# Altium project Adapter_UARTSPI_RS485.PrjPcb
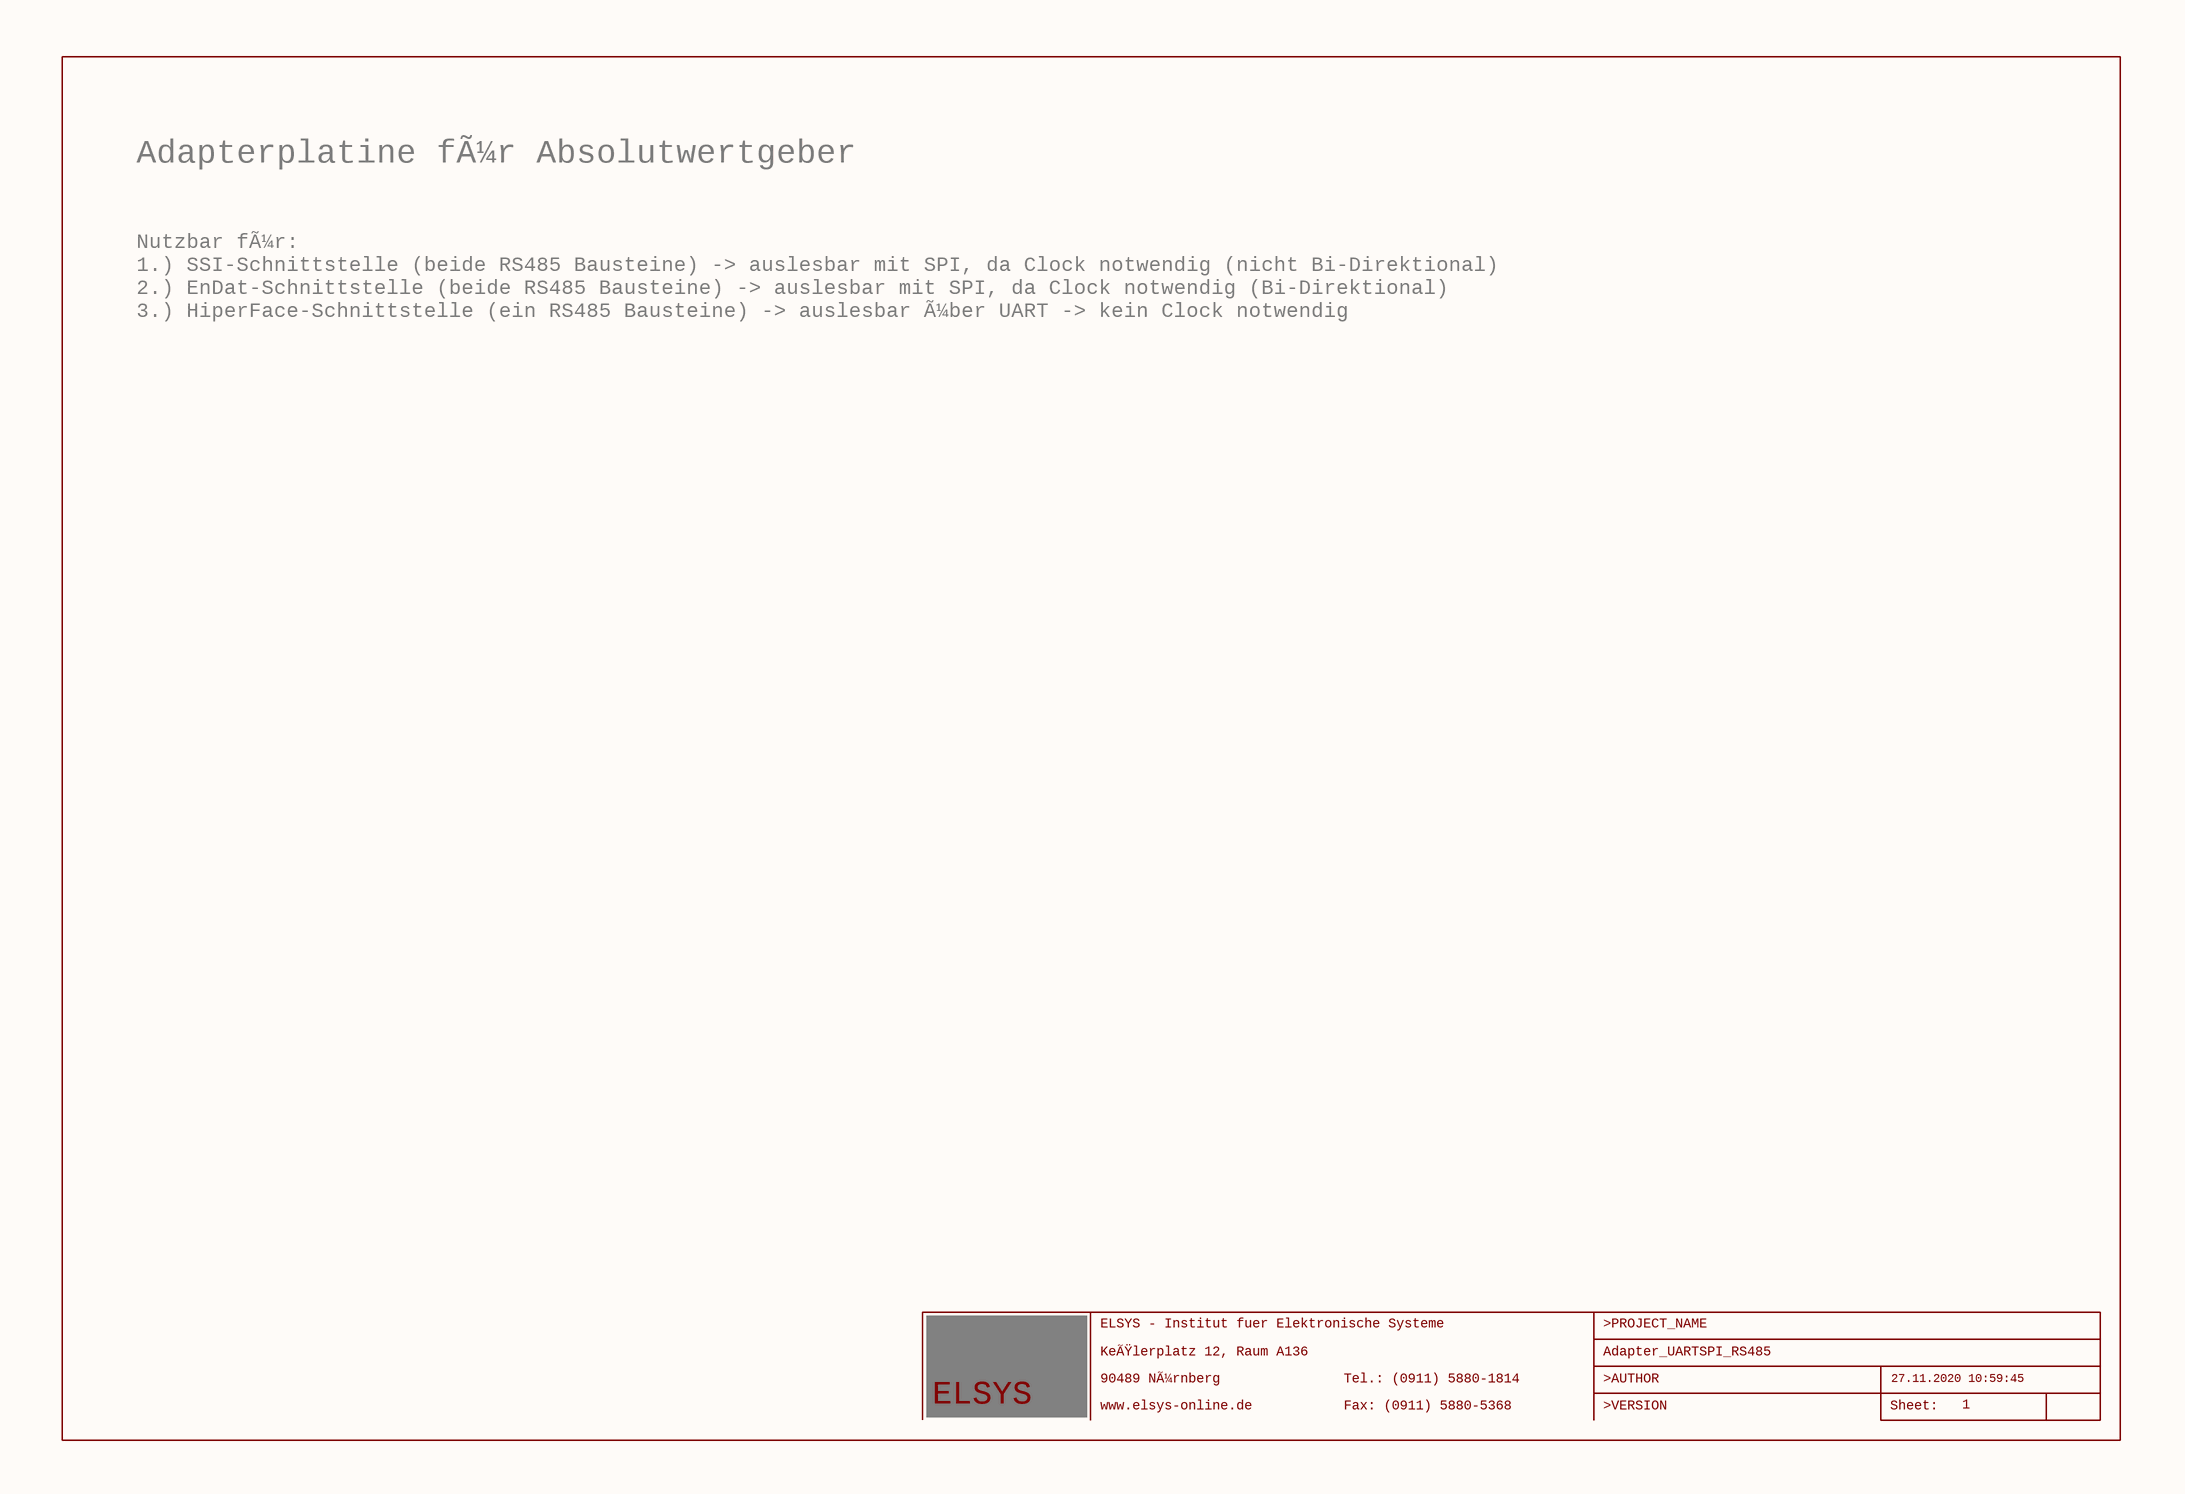
[diagram p0: Adapter_UARTSPI_RS485_0.SchDoc]
2 sheets, 47 parts. Net scope: global (net labels, ports and power ports of the same name join across sheets).
Board file: Adapter_UARTSPI_RS485.PcbDoc
Sheets:
  Adapter_UARTSPI_RS485_0.SchDoc
  Adapter_UARTSPI_RS485_1.SchDoc

## Sheet Adapter_UARTSPI_RS485_0.SchDoc
size 409 x 279 mm; Author: Wendel; PROJECT_NAME: Adapter_UARTSPI_RS485; VERSION: Version 1.0; Origin: Eagle

### Parts
FRAME3  DRAWING_NAME: Adapter_UARTSPI_RS485  LAST_DATE_TIME: 27.11.2020 10:59:45  SHEET: 1  Sheet: Sheet:  ELSYS-InstitutfuerElektronischeSysteme: ELSYS - Institut fuer Elektronische Systeme  AUTHOR: >AUTHOR  VERSION: >VERSION  KeÃŸlerplatz12,RaumA136: KeÃŸlerplatz 12, Raum A136  90489NÃ¼rnberg: 90489 NÃ¼rnberg  Tel.:(0911)5880-1814: Tel.: (0911) 5880-1814  Fax:(0911)5880-5368: Fax: (0911) 5880-5368  PROJECT_NAME: >PROJECT_NAME  (hidden comment: A3L-LOC)

### Notes on the sheet
- Adapterplatine fÃ¼r Absolutwertgeber
- Nutzbar fÃ¼r:
  1.) SSI-Schnittstelle (beide RS485 Bausteine) -> auslesbar mit SPI, da Clock notwendig (nicht Bi-Direktional)
  2.) EnDat-Schnittstelle (beide RS485 Bausteine) -> auslesbar mit SPI, da Clock notwendig (Bi-Direktional)
  3.) HiperFace-Schnittstelle (ein RS485 Bausteine) -> auslesbar Ã¼ber UART -> kein Clock notwendig

### Library data of the parts
FRAME3 = A3L-LOC: RAHMEN   ELSYS Rahmen fuer Schaltplan; GateName_1: G$1; SymbolName_1: A3L-LOC; LibraryName: Elsys - Rahmen - Eagle v5; DeviceSetName: A3L-LOC; www.elsys-online.de: www.elsys-online.de; ELSYS: ELSYS

## Sheet Adapter_UARTSPI_RS485_1.SchDoc: Adapter_UARTSPI_RS485
size 414 x 279 mm; Date: 27.11.2020 10:59:45; SheetNumber: 2; Author: Wendel; PROJECT_NAME: Adapter_UARTSPI_RS485; VERSION: Version 1.0; Origin: Eagle; GateName_1: G$1; SymbolName_1: A3L-LOC; LibraryName: Elsys - Rahmen - Eagle v5; DeviceSetName: A3L-LOC; Sheet: Sheet:; ELSYS-InstitutfuerElektronischeSysteme: ELSYS - Institut fuer Elektronische Systeme; KeÃŸlerplatz12,RaumA136: KeÃŸlerplatz 12, Raum A136; 90489NÃ¼rnberg: 90489 NÃ¼rnberg; www.elsys-online.de: www.elsys-online.de; Tel.:(0911)5880-1814: Tel.: (0911) 5880-1814; Fax:(0911)5880-5368: Fax: (0911) 5880-5368; ELSYS: ELSYS
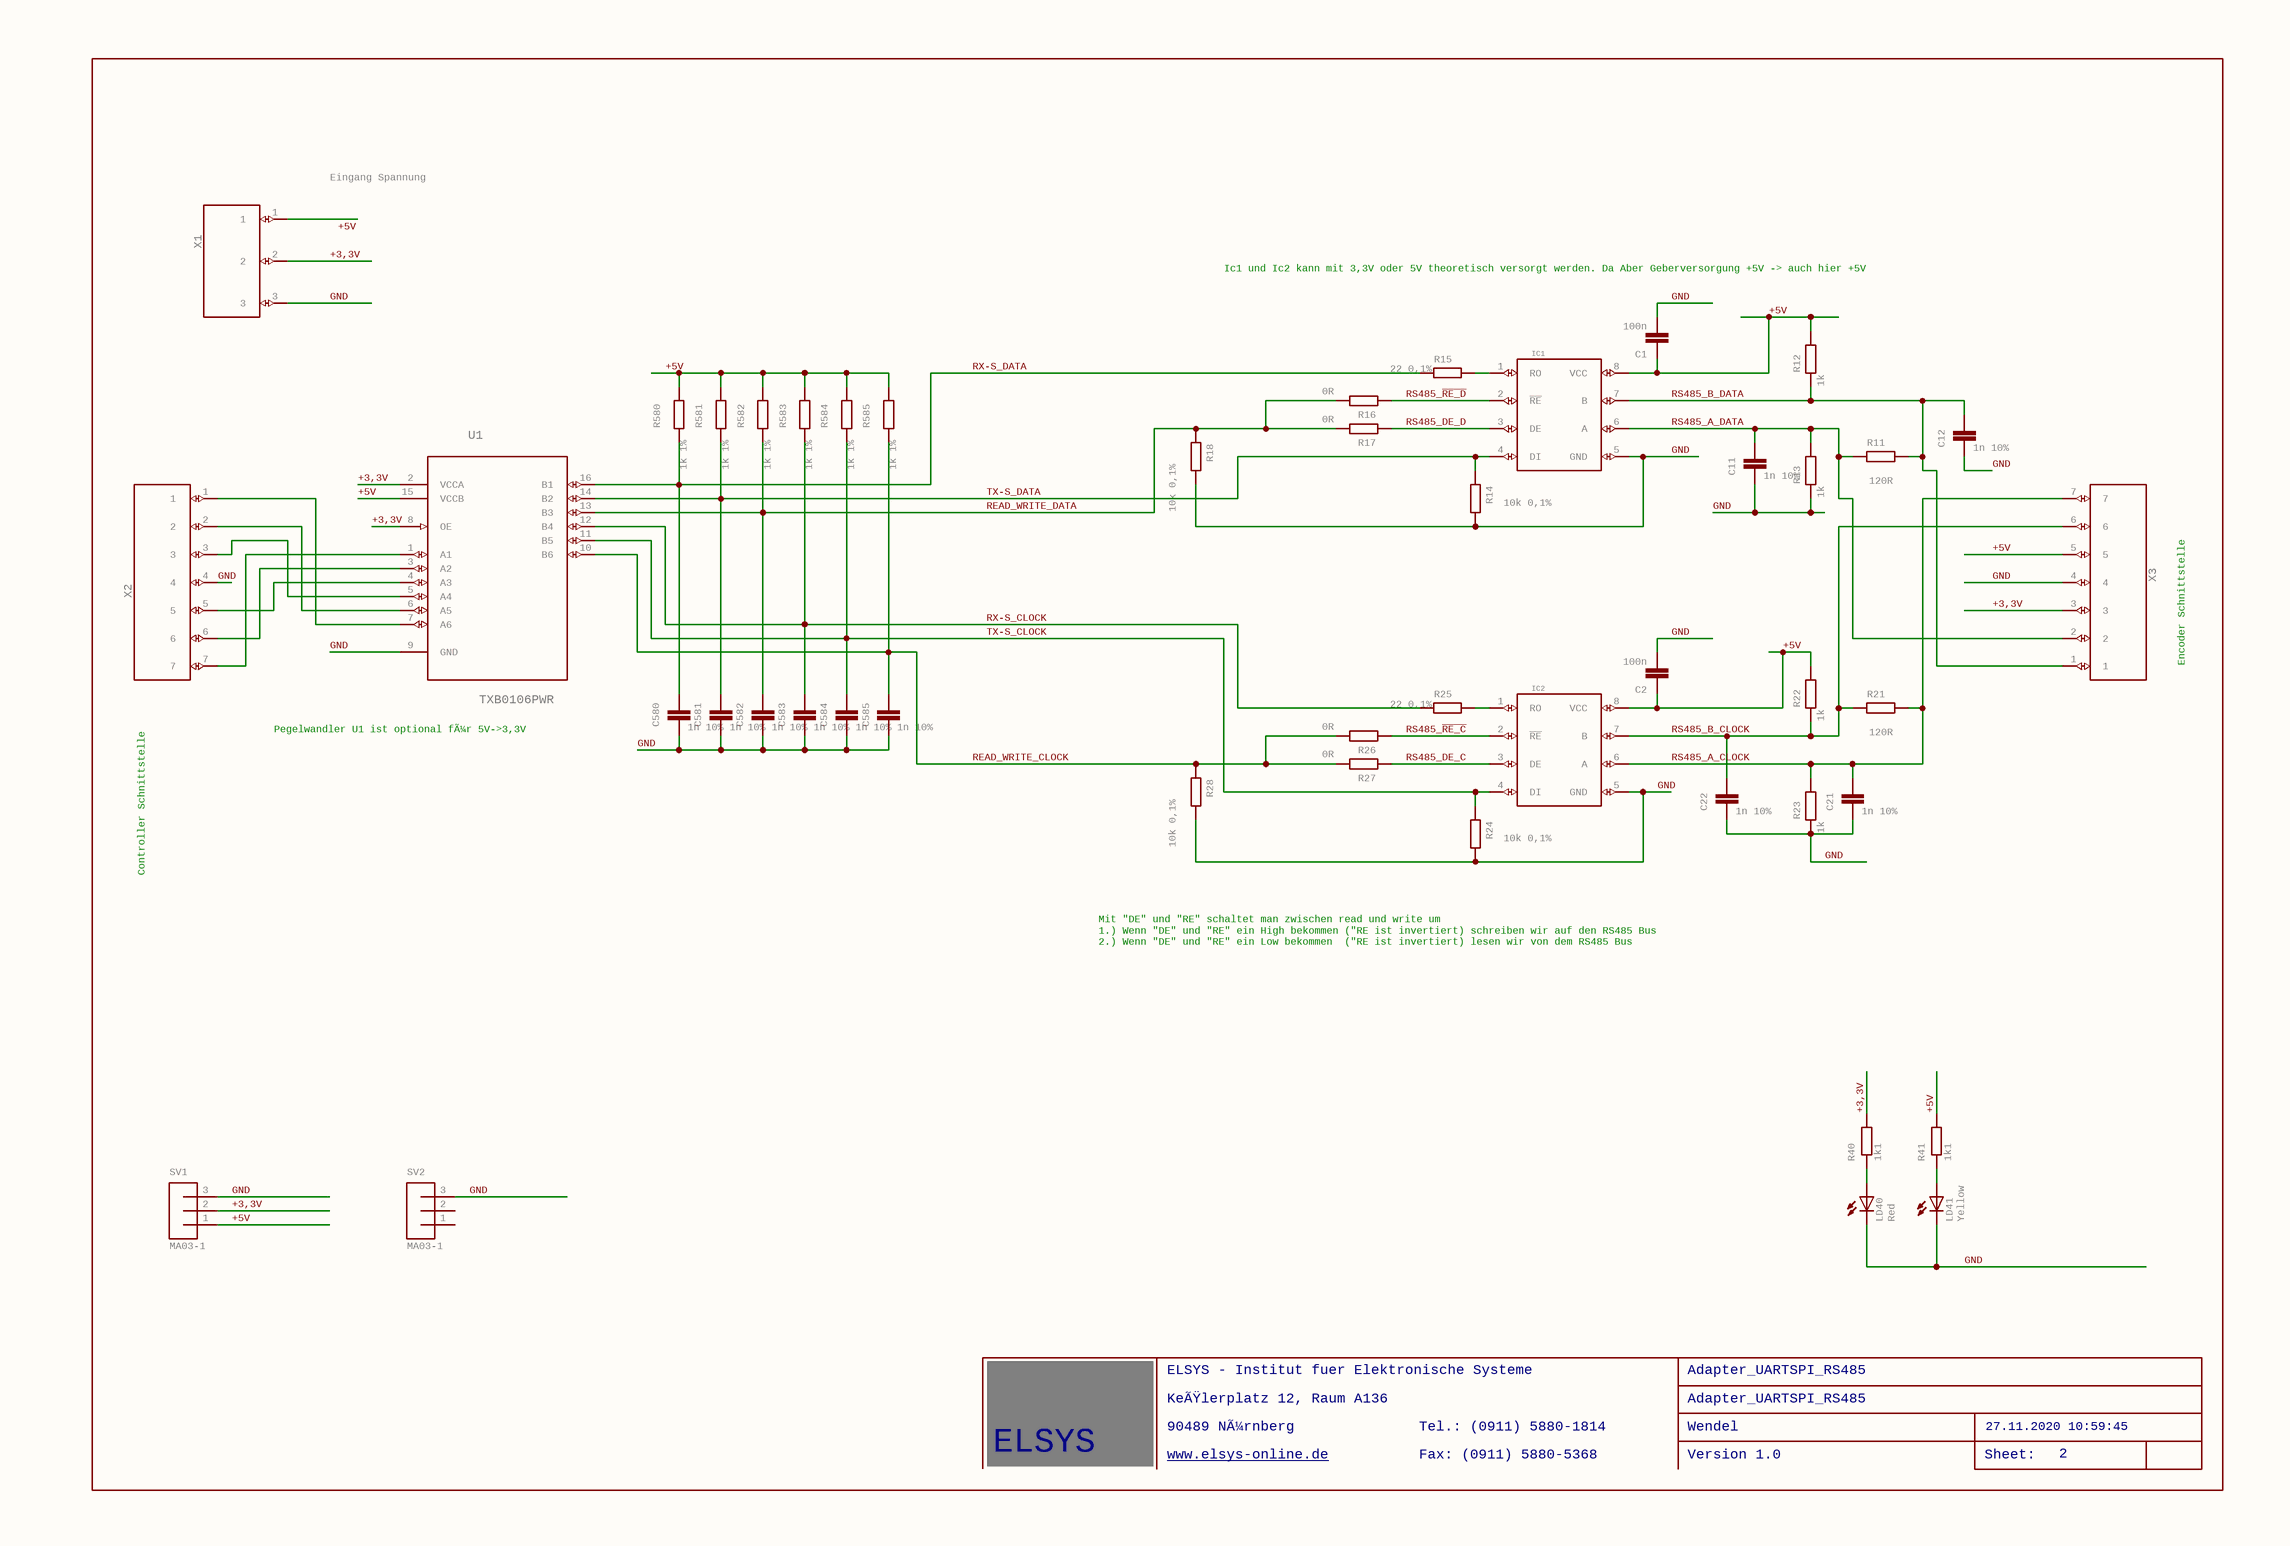
[diagram p1: Adapter_UARTSPI_RS485_1.SchDoc]

### Parts
C1  100n  [SMD-0603]
C2  100n  [SMD-0603]
C11  1n 10%  [SMD-0603]
C12  1n 10%  [SMD-0603]
C21  1n 10%  [SMD-0603]
C22  1n 10%  [SMD-0603]
C580  1n 10%  [SMD-0603]
C581  1n 10%  [SMD-0603]
C582  1n 10%  [SMD-0603]
C583  1n 10%  [SMD-0603]
C584  1n 10%  [SMD-0603]
C585  1n 10%  [SMD-0603]
IC1  RS485-MAXIM  [SOIC8]  (value not drawn)
IC2  RS485-MAXIM  [SOIC8]  (value not drawn)
LD40  Red  [CHIP-LED0805]
LD41  Yellow  [CHIP-LED0805]
R11  120R  [R0603]
R12  1k  [R0603]
R13  1k  [R0603]
R14  10k 0,1%  [R0603]
R15  22 0,1%  [R0603]
R16  0R  [R0603]
R17  0R  [R0603]
R18  10k 0,1%  [R0603]
R21  120R  [R0603]
R22  1k  [R0603]
R23  1k  [R0603]
R24  10k 0,1%  [R0603]
R25  22 0,1%  [R0603]
R26  0R  [R0603]
R27  0R  [R0603]
R28  10k 0,1%  [R0603]
R40  1k1  [R0805]
R41  1k1  [R0805]
R580  1k 1%  [R0603]
R581  1k 1%  [R0603]
R582  1k 1%  [R0603]
R583  1k 1%  [R0603]
R584  1k 1%  [R0603]
R585  1k 1%  [R0603]
SV1  MA03-1  [MA03-1]
SV2  MA03-1  [MA03-1]
U1  TXB0106PWR  [SOP65P640X120-16N]
X1  KLEMME_3POLIG_2,54  [KLEMME_3POLIG_2,54]  (value not drawn)
X2  KLEMME_7POLIG_2,54  [KLEMME_7POLIG_2,54]  (value not drawn)
X3  KLEMME_7POLIG_2,54  [KLEMME_7POLIG_2,54]  (value not drawn)

### Nets
+3,3V: R40.2 SV1.2 U1.2(VCCA) U1.8(OE) X1.2 X3.3
+5V: C1.1 C2.1 IC1.8(VCC) IC2.8(VCC) R12.1 R22.1 R41.2 R580.2 R581.2 R582.2 R583.2 R584.2 R585.2 SV1.1 U1.15(VCCB) X1.1 X3.5
GND: C1.2 C2.2 C11.2 C12.2 C21.2 C22.2 C580.2 C581.2 C582.2 C583.2 C584.2 C585.2 IC1.5(GND) IC2.5(GND) LD40.C LD41.C R13.2 R14.1 R18.1 R23.2 R24.1 R28.1 SV1.3 SV2.3 U1.9(GND) X1.3 X2.4 X3.4
READ_WRITE_CLOCK: C585.1 R26.1 R27.1 R28.2 R585.1 U1.10(B6)
READ_WRITE_DATA: C582.1 R16.1 R17.1 R18.2 R582.1 U1.13(B3)
RS485_A_CLOCK: C21.1 IC2.6(A) R21.1 R23.1 X3.7
RS485_A_DATA: C11.1 IC1.6(A) R11.2 R13.1 X3.2
RS485_B_CLOCK: C22.1 IC2.7(B) R21.2 R22.2 X3.6
RS485_B_DATA: C12.1 IC1.7(B) R11.1 R12.2 X3.1
RS485_DE_C: IC2.3(DE) R27.2
RS485_DE_D: IC1.3(DE) R17.2
RS485_~{RE_C}: IC2.2(~{RE}) R26.2
RS485_~{RE_D}: IC1.2(~{RE}) R16.2
RX-S_CLOCK: C583.1 R25.2 R583.1 U1.12(B4)
RX-S_DATA: C580.1 R15.2 R580.1 U1.16(B1)
TX-S_CLOCK: C584.1 IC2.4(DI) R24.2 R584.1 U1.11(B5)
TX-S_DATA: C581.1 IC1.4(DI) R14.2 R581.1 U1.14(B2)
NetIC1_1: IC1.1(RO) R15.1
NetIC2_1: IC2.1(RO) R25.1
NetLD40_A: LD40.A R40.1
NetLD41_A: LD41.A R41.1
NetU1_1: U1.1(A1) X2.7
NetU1_3: U1.3(A2) X2.6
NetU1_4: U1.4(A3) X2.5
NetU1_5: U1.5(A4) X2.3
NetU1_6: U1.6(A5) X2.2
NetU1_7: U1.7(A6) X2.1

Not connected (* = marked no-connect by the designer): SV2 1 2

### Notes on the sheet
- Eingang Spannung
- Ic1 und Ic2 kann mit 3,3V oder 5V theoretisch versorgt werden. Da Aber Geberversorgung +5V -> auch hier +5V
- Encoder Schnittstelle
- Pegelwandler U1 ist optional fÃ¼r 5V->3,3V
- Controller Schnittstelle
- Mit "DE" und "RE" schaltet man zwischen read und write um
  1.) Wenn "DE" und "RE" ein High bekommen ("RE ist invertiert) schreiben wir auf den RS485 Bus
  2.) Wenn "DE" und "RE" ein Low bekommen  ("RE ist invertiert) lesen wir von dem RS485 Bus
- ELSYS - Institut fuer Elektronische Systeme
- KeÃŸlerplatz 12, Raum A136
- 90489 NÃ¼rnberg
- Tel.: (0911) 5880-1814
- Adapter_UARTSPI_RS485
- Wendel
- 27.11.2020 10:59:45
- ELSYS
- www.elsys-online.de <http://www.elsys-online.de>
- Fax: (0911) 5880-5368
- Version 1.0
- Sheet:
- 2

### Library data of the parts
C1 C2 C11 C12 C21 C22 C580-C585 = C-EU0603: CAPACITOR, European symbol; GateName_1: G$1; SymbolName_1: C-EU; DeviceName: 0603; LibraryName: Elsys - Kondenstatoren; DeviceSetName: C-EU
IC1 IC2 = RS485-MAXIM: GateName_1: G$1; SymbolName_1: RS485-MAXIM; LibraryName: ELSYS - Symetrierung; DeviceSetName: RS485-MAXIM
LD40 LD41 = LEDCHIP-LED0805: LED   OSRAM: - CHIPLED LG R971, LG N971, LY N971, LG Q971, LY Q971, LO R971, LY R971 LH N974, LH R974 LS Q976, LO Q976, LY Q976 LO Q996 - Hyper CHIPLED LW Q18S LB Q993, LB Q99A, LB R99A - SideLED LS A670, LO A670, LY A670, LG A670, LP A670 LB A673, LV A673, LT A673, LW A673 LH A674 LY A675 LS A676, LA A676, LO A676, LY A676, LW A676 LS A679, LY A679, LG A679 -  Hyper Micro SIDELEDÂ® LS Y876, LA Y876, LO Y876, LY Y876 LT Y87S - SmartLED LW L88C, LW L88S LB L89C, LB L89S, LG L890 LS L89K, LO L89K, LY L89K LS L896, LA L896, LO L896, LY L896 - TOPLED LS T670, LO T670, LY T670, LG T670, LP T670 LSG T670, LSP T670, LSY T670, LOP T670, LYG T670 LG T671, LOG T671, LSG T671 LB T673, LV T673, LT T673, LW T673 LH T674 LS T676, LA T676, LO T676, LY T676, LB T676, LH T676, LSB T676, LW T676 LB T67C, LV T67C, LT T67C, LS T67K, LO T67K, LY T67K, LW E67C LS E67B, LA E67B, LO E67B, LY E67B, LB E67C, LV E67C, LT E67C LW T67C LS T679, LY T679, LG T679 LS T770, LO T770, LY T770, LG T770, LP T770 LB T773, LV T773, LT T773, LW T773 LH T774 LS E675, LA E675, LY E675, LS T675 LS T776, LA T776, LO T776, LY T776, LB T776 LHGB T686 LT T68C, LB T68C - Hyper Mini TOPLEDÂ® LB M676 - Mini TOPLED SantanaÂ® LG M470 LS M47K, LO M47K, LY M47K    Source: http://www.osram.convergy.de   LUXEON: - LUMILEDÂ® LXK2-PW12-R00, LXK2-PW12-S00, LXK2-PW14-U00, LXK2-PW14-V00 LXK2-PM12-R00, LXK2-PM12-S00, LXK2-PM14-U00 LXK2-PE12-Q00, LXK2-PE12-R00, LXK2-PE12-S00, LXK2-PE14-T00, LXK2-PE14-U00 LXK2-PB12-K00, LXK2-PB12-L00, LXK2-PB12-M00, LXK2-PB14-N00, LXK2-PB14-P00, LXK2-PB14-Q00 LXK2-PR12-L00, LXK2-PR12-M00, LXK2-PR14-Q00, LXK2-PR14-R00 LXK2-PD12-Q00, LXK2-PD12-R00, LXK2-PD12-S00 LXK2-PH12-R00, LXK2-PH12-S00 LXK2-PL12-P00, LXK2-PL12-Q00, LXK2-PL12-R00    Source: www.luxeon.com   KINGBRIGHT:   KA-3528ASYC Source: www.kingbright.com; GateName_1: G$1; SymbolName_1: LED; DeviceName: CHIP-LED0805; LibraryName: led (2); DeviceSetName: LED
R11-R18 R21-R28 R580-R585 = R-EU_R0603: RESISTOR, European symbol; GateName_1: G$1; SymbolName_1: R-EU; DeviceSetName: R-EU_; DeviceName: R0603; LibraryName: Elsys - Widerstaende
R40 R41 = R-EU_R0805: RESISTOR, European symbol; GateName_1: G$1; SymbolName_1: R-EU; DeviceSetName: R-EU_; DeviceName: R0805; LibraryName: Elsys - Widerstaende
SV1 SV2 = MA03-1: PIN HEADER; GateName_1: G$1; SymbolName_1: MA03-1; LibraryName: Elsys - Stiftleisten; DeviceSetName: MA03-1
U1 = TXB0106PWR: VOLTAGE-LEVEL TRANSLATOR; GateName_1: A; SymbolName_1: TXB0106PWR; LibraryName: Texas Instruments_By_element14_Batch_1; DeviceSetName: TXB0106PWR; MPN: TXB0106PWR; OC_FARNELL: 1694679; OC_NEWARK: 46P3786; PACKAGE: TSSOP-16; SUPPLIER: Texas Instruments
X1 = KLEMME_3POLIG_2,54: GateName_1: G$1; SymbolName_1: KLEMME_3POLIG; LibraryName: ELSYS - Symetrierung; DeviceSetName: KLEMME_3POLIG_2,54
X2 X3 = KLEMME_7POLIG_2,54: GateName_1: G$1; SymbolName_1: KLEMME_7POLIG; LibraryName: ELSYS - Symetrierung; DeviceSetName: KLEMME_7POLIG_2,54